# EAGLE schematic usbDac (EAGLE 6.4)
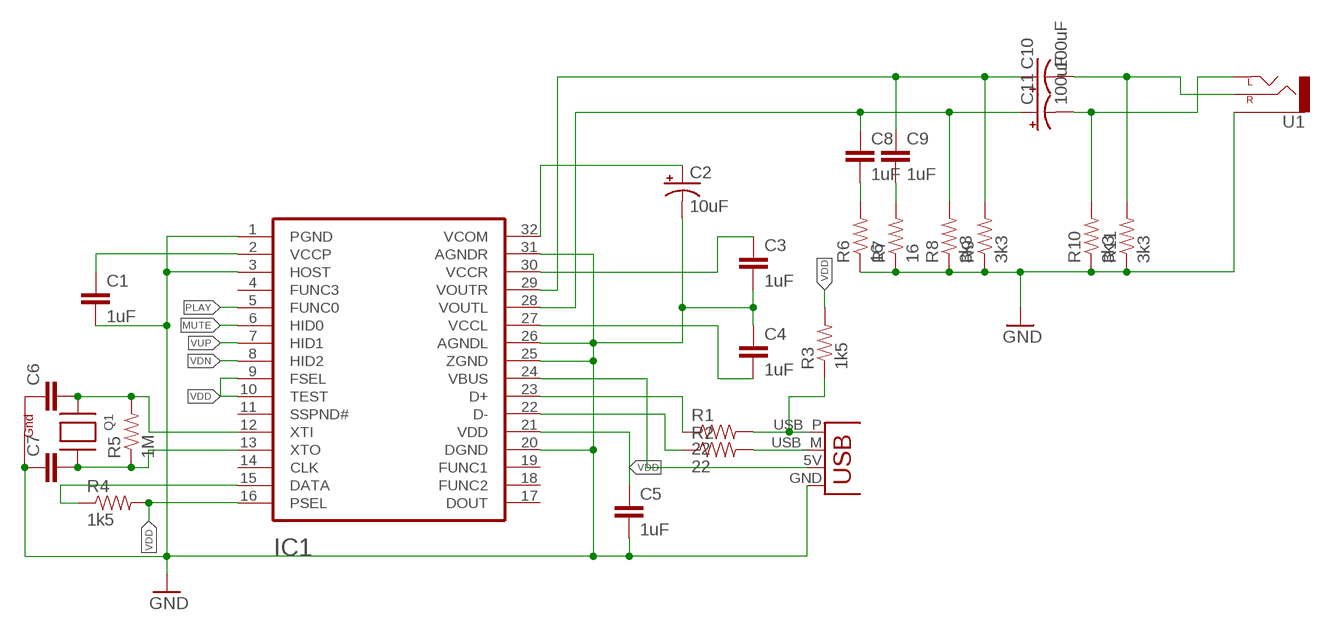
[diagram p0: schematic, sheet 1]

## Parts
C1  1uF  CAP0402-CAP  [0402-CAP]
C2  10uF  CAP_POL1206  [EIA3216]
C3  1uF  CAP0402-CAP  [0402-CAP]
C4  1uF  CAP0402-CAP  [0402-CAP]
C5  1uF  CAP0402-CAP  [0402-CAP]
C6  CAP0402-CAP  [0402-CAP]
C7  CAP0402-CAP  [0402-CAP]
C8  1uF  CAP0402-CAP  [0402-CAP]
C9  1uF  CAP0402-CAP  [0402-CAP]
C10  100uF  CAP_POL6032  [EIA6032]
C11  100uF  CAP_POL6032  [EIA6032]
IC1  PCM2706  [TQFP32]
Q1  XTAL-4-3225  [NX3225]
R1  22  RESISTOR0402-RES  [0402-RES]
R2  22  RESISTOR0402-RES  [0402-RES]
R3  1k5  RESISTOR0402-RES  [0402-RES]
R4  1k5  RESISTOR0402-RES  [0402-RES]
R5  1M  RESISTOR0402-RES  [0402-RES]
R6  16  RESISTOR0402-RES  [0402-RES]
R7  16  RESISTOR0402-RES  [0402-RES]
R8  3k3  RESISTOR0402-RES  [0402-RES]
R9  3k3  RESISTOR0402-RES  [0402-RES]
R10  3k3  RESISTOR0402-RES  [0402-RES]
R11  3k3  RESISTOR0402-RES  [0402-RES]
U1  AUDIO-JACKSMD2  [AUDIO-JACK-3.5MM-SMD]
X1  USBPCB  [USB-A-PCB]

## Nets
GND: C1.2 C2.C(-) C3.2 C4.1 C5.2 C7.1 IC1.1(PGND) IC1.3(HOST) IC1.20(DGND) IC1.25(ZGND) IC1.26(AGNDL) IC1.31(AGNDR) Q1.2(G2) R6.1 R7.1 R8.1 R9.1 R10.1 R11.1 U1.SLEEVE X1.GND
MUTE: IC1.6(HID0)
N$1: C3.1 IC1.30(VCCR)
N$2: C1.1 IC1.2(VCCP)
N$3: C2.A(+) IC1.32(VCOM)
N$4: C4.2 IC1.27(VCCL)
N$6: IC1.23(D+) R1.1
N$7: IC1.22(D-) R2.1
N$8: R1.2 R3.1 X1.USB_P(D+)
N$9: R2.2 X1.USB_M(D-)
N$10: C7.2 IC1.13(XTO) Q1.3(X2) R5.1
N$11: IC1.15(DATA) R4.1
N$12: C9.1 C10.P$1(+) IC1.29(VOUTR) R9.2
N$13: C6.1 Q1.4(G1)
N$14: C8.1 C11.P$1(+) IC1.28(VOUTL) R8.2
N$15: C6.2 IC1.12(XTI) Q1.1(X1) R5.2
N$16: C8.2 R6.2
N$17: C9.2 R7.2
N$18: C11.P$2(-) R10.2 U1.TIP(LEFT)
N$19: C10.P$2(-) R11.2 U1.RING(RIGHT)
PLAY: IC1.5(FUNC0)
VCC: IC1.24(VBUS) X1.5V(VBUS)
VDD: C5.1 IC1.9(FSEL) IC1.10(TEST) IC1.16(PSEL) IC1.21(VDD) R3.2 R4.2
VDN: IC1.8(HID2)
VUP: IC1.7(HID1)
Unconnected: IC1.4(FUNC3) IC1.11(SSPND#) IC1.14(CLK) IC1.17(DOUT) IC1.18(FUNC2) IC1.19(FUNC1)

## Library data of the parts
C1 C3-C9 = SparkFun-Capacitors:CAP: Capacitor Standard 0603 ceramic capacitor, and 0.1" leaded capacitor.
C2 C10 C11 = SparkFun-Capacitors:CAP_POL: Capacitor Polarized These are standard SMD and PTH capacitors. Normally 10uF, 47uF, and 100uF in electrolytic and tantalum varieties. Always verify the external diameter of the through hole cap, it varies with capacity, voltage, and manufacturer. The EIA devices should be standard.
IC1 = PCM2706:PCM2706
Q1 = adafruit:XTAL-4: Classic 4-pin 3.2 x 2.5mm crystal
R1-R11 = SparkFun-Passives:RESISTOR: Resistor Basic schematic elements and footprints for 0603, 1206, and PTH resistors.
U1 = SparkFun-Connectors:AUDIO-JACK: 3.5mm Audio Jack Simple 3.5mm common PCB mount audio jack. SKU: PRT-08032
X1 = SparkFun:USB: USB Connectors USB-B-PTH is fully proven SKU : PRT-00139 USB-miniB is fully proven SKU : PRT-00587 USB-A-PCB is untested. USB-A-H is throughly reviewed, but untested. Spark Fun Electronics SKU : PRT-00437 USB-B-SMT is throughly reviewed, but untested. Needs silkscreen touching up. USB-A-S has not been used/tested USB-MB-H has not been used/tested